# Altium schematic sheet LEDs.SchDoc: LEDs
size A; Date: Not used; ApprovedBy: Not used; CheckedBy: Not used; Author: Not used; CompanyName: STMicroelectronics; DrawnBy: Not used; Engineer: Not used; Organization: Not used; Address1: Not used; Address2: Not used; Address3: Not used; Address4: Not used; DocumentNumber: Not used; Revision: 1.0.0; SheetNumber: 5; SheetTotal: 6; CurrentTime: Not used; CurrentDate: Not used; Time: Not used; DocumentFullPathAndName: Not used; DocumentName: Not used; ModifiedDate: Not used; ImagePath: Not used; ProjectName: Not used; Application_BuildNumber: Not used
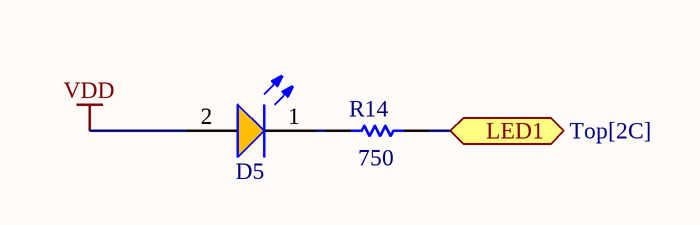
[diagram p0: LEDs.SchDoc]

## Parts
D5  Amber, 2V, 120°  [WL-SMTW_3528]  (value not drawn)
R14  value 750  [R0402]  (hidden comment: Resistor)

## Ports
LED1 (bidir, see Top[2C])

## Nets
VDD: D5.2(A)
LED1: R14.2 ; port LED1
NetD5_1: D5.1(K) R14.1

## Notes on the sheet
- Title:
- Size:
- Date:
- A
- Revision:
- Sheet
- of
- File:

## Library data of the parts
D5 = 150141AS73100: WL-SMTW Mono-color TOP LED Waterclear, size 3528, Amber, 2V, 120°; Manufacturer: Wurth Elektronik; Case/Size Code: 3528; Chip Technology: AlInGaP; Dominant Wavelength: 605nm; Luminous Intensity: 330mcd; Peak Wavelength: 610nm; Manufacturer Part Number: 150141AS73100; Category: Signal LEDs; Match Code: WL-SMTW; ComponentLink1Description: Website Link; ComponentLink1URL: https://www.we-online.com/redexpert/article/150141AS73100?ad; ComponentLink2Description: Datasheet Link; ComponentLink2URL: https://www.we-online.com/redexpert/spec/150141AS73100?ad; Mount: Surface Mount; Operating Temperature Max: 85°C; Operating Temperature Min: -40°C; Packaging: Tape and Reel; Length: 3.5mm; Width: 2.8mm; Height: 1.9mm; Emitting Color: Amber; Forward Voltage: 2V; Viewing Angle: 120°
R14 = MCD-01819: SMD Chip Resistor, 750 Ohm; Manufacturer: Wurth; Manufacturer Part Number: 560112110262; ComponentLink1URL: http://tunmcdsvn.tun.st.com/Component_Documentation_Library/Trunk/Resistor/YAGEO_RC_L_Series; Supplier 1: Mouser; RoHS: Yes; Category: Chip SMD Resistors; ComponentLink2URL: https://datasheet.ciiva.com/29507/crt-29507835.pdf?src-supplier=Digikey; ComponentLink2Description: https://datasheet.ciiva.com/29507/crt-29507835.pdf?src-supplier=Digikey